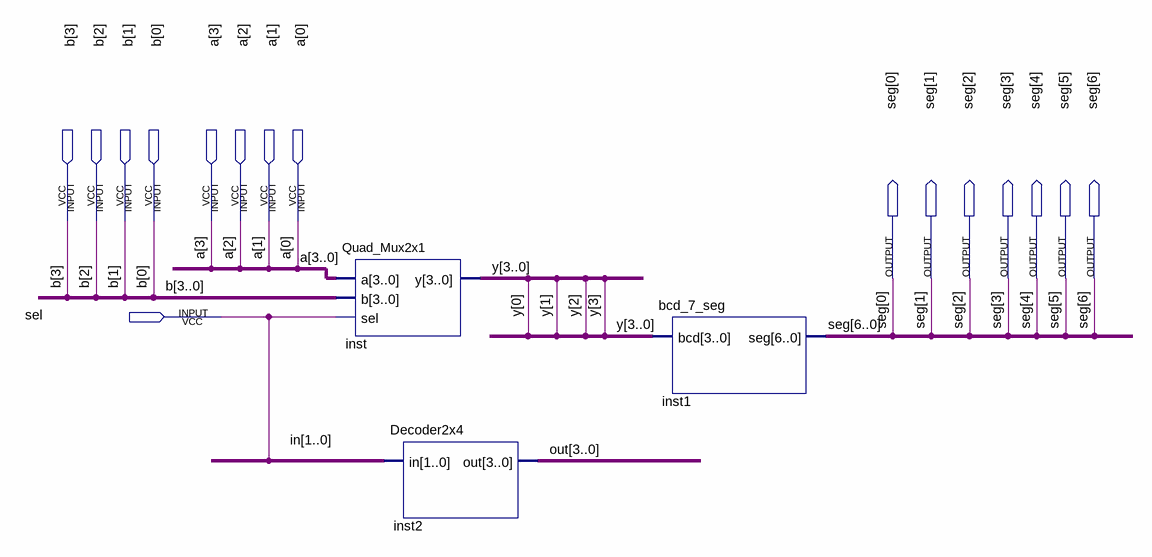
[diagram p0: schematic sheet]
// Quartus schematic full_circuit.bdf as structural Verilog: 3 symbols, 16 pins
module full_circuit (
  input  [3:0] b,
  input  [3:0] a,
  input  sel,
  output [6:0] seg
);

  wire [1:0] in;
  wire [3:0] out, y;

  Quad_Mux2x1 inst (.a(a), .b(b), .sel(sel), .y(y));
  Decoder2x4 inst2 (.in(in), .out(out));
  bcd_7_seg inst1 (.bcd(y), .seg(seg));
endmodule
